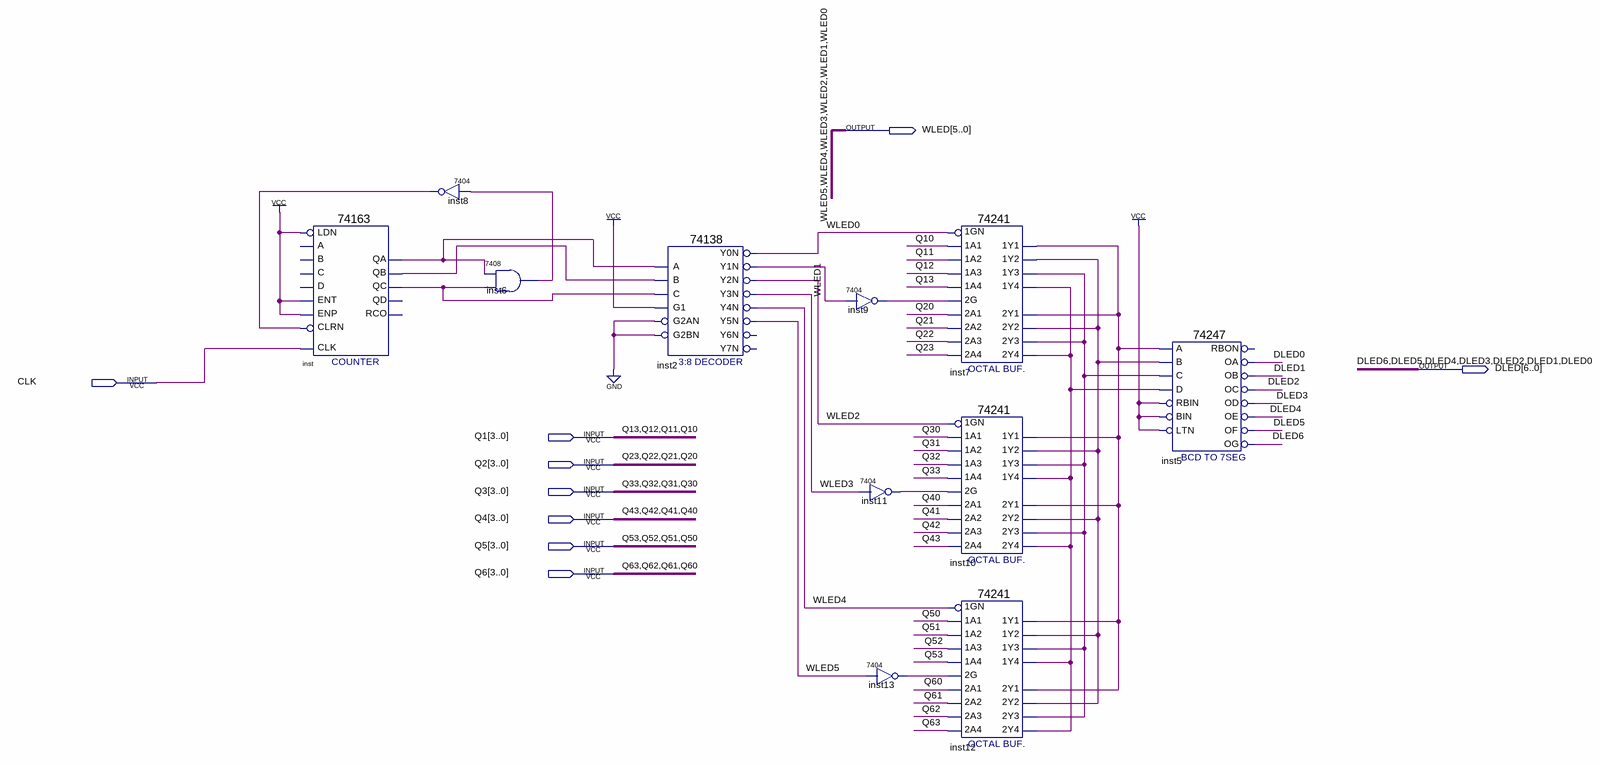
[diagram p0: schematic sheet]
// Quartus schematic led_shower.bdf as structural Verilog: 11 symbols, 9 pins
module led_shower (
  input  CLK,
  input  [3:0] Q1,
  input  [3:0] Q2,
  input  [3:0] Q3,
  input  [3:0] Q4,
  input  [3:0] Q5,
  input  [3:0] Q6,
  output [5:0] WLED,
  output [6:0] DLED
);

  wire inst6_1, inst7_1y1, inst7_1y2, inst7_1y3, inst7_1y4, inst8_1, inst9_1, inst11_1, inst13_1, inst_qa,
       inst_qb, inst_qc;

  \74163  inst (
    .ENT(1'b1), .CLRN(inst8_1), .CLK(CLK), .ENP(1'b1), .LDN(1'b1), .QA(inst_qa), .QB(inst_qb), .QC(inst_qc));  // open: C, B, A, D, QD, RCO
  \7404  inst8 (.\2 (inst6_1), .\1 (inst8_1));
  \7408  inst6 (.\3 (inst_qc), .\2 (inst_qa), .\1 (inst6_1));
  \74138  inst2 (
    .A(inst_qa), .B(inst_qb), .G1(1'b1), .C(inst_qc), .G2AN(1'b0), .G2BN(1'b0), .Y0N(WLED[0]), .Y1N(WLED[1]),
    .Y2N(WLED[2]), .Y3N(WLED[3]), .Y4N(WLED[4]), .Y5N(WLED[5]));  // open: Y6N, Y7N
  \7404  inst9 (.\2 (WLED[1]), .\1 (inst9_1));
  \7404  inst11 (.\2 (WLED[3]), .\1 (inst11_1));
  \7404  inst13 (.\2 (WLED[5]), .\1 (inst13_1));
  \74241  inst7 (
    .\1GN (WLED[0]), .\1A1 (Q1[0]), .\1A3 (Q1[2]), .\1A2 (Q1[1]), .\1A4 (Q1[3]), .\2A2 (Q2[1]),
    .\2A1 (Q2[0]), .\2G (inst9_1), .\2A4 (Q2[3]), .\2A3 (Q2[2]), .\1Y1 (inst7_1y1), .\1Y4 (inst7_1y4),
    .\1Y3 (inst7_1y3), .\1Y2 (inst7_1y2), .\2Y3 (inst7_1y3), .\2Y2 (inst7_1y2), .\2Y1 (inst7_1y1),
    .\2Y4 (inst7_1y4));
  \74241  inst10 (
    .\1GN (WLED[2]), .\1A1 (Q3[0]), .\1A3 (Q3[2]), .\1A2 (Q3[1]), .\1A4 (Q3[3]), .\2A2 (Q4[1]),
    .\2A1 (Q4[0]), .\2G (inst11_1), .\2A4 (Q4[3]), .\2A3 (Q4[2]), .\1Y1 (inst7_1y1), .\1Y4 (inst7_1y4),
    .\1Y3 (inst7_1y3), .\1Y2 (inst7_1y2), .\2Y3 (inst7_1y3), .\2Y2 (inst7_1y2), .\2Y1 (inst7_1y1),
    .\2Y4 (inst7_1y4));
  \74241  inst12 (
    .\1GN (WLED[4]), .\1A1 (Q5[0]), .\1A3 (Q5[2]), .\1A2 (Q5[1]), .\1A4 (Q5[3]), .\2A2 (Q6[1]),
    .\2A1 (Q6[0]), .\2G (inst13_1), .\2A4 (Q6[3]), .\2A3 (Q6[2]), .\1Y1 (inst7_1y1), .\1Y4 (inst7_1y4),
    .\1Y3 (inst7_1y3), .\1Y2 (inst7_1y2), .\2Y3 (inst7_1y3), .\2Y2 (inst7_1y2), .\2Y1 (inst7_1y1),
    .\2Y4 (inst7_1y4));
  \74247  inst5 (
    .LTN(1'b1), .BIN(1'b1), .A(inst7_1y1), .B(inst7_1y2), .RBIN(1'b1), .C(inst7_1y3), .D(inst7_1y4),
    .OF(DLED[5]), .OC(DLED[2]), .OD(DLED[3]), .OE(DLED[4]), .OA(DLED[0]), .OB(DLED[1]), .OG(DLED[6]));  // open: RBON
endmodule
